# EasyEDA schematic SCH_GP40_R1A.json

## Sheets
1 01_main: TITLE: GALAKSIJA 40th Anniversary Tribute; REV: 1.0; Date: 2023-12-30; Sheet: 0/3; Drawn By: mikica; Company: Umuntu ngumuntu ngabantu
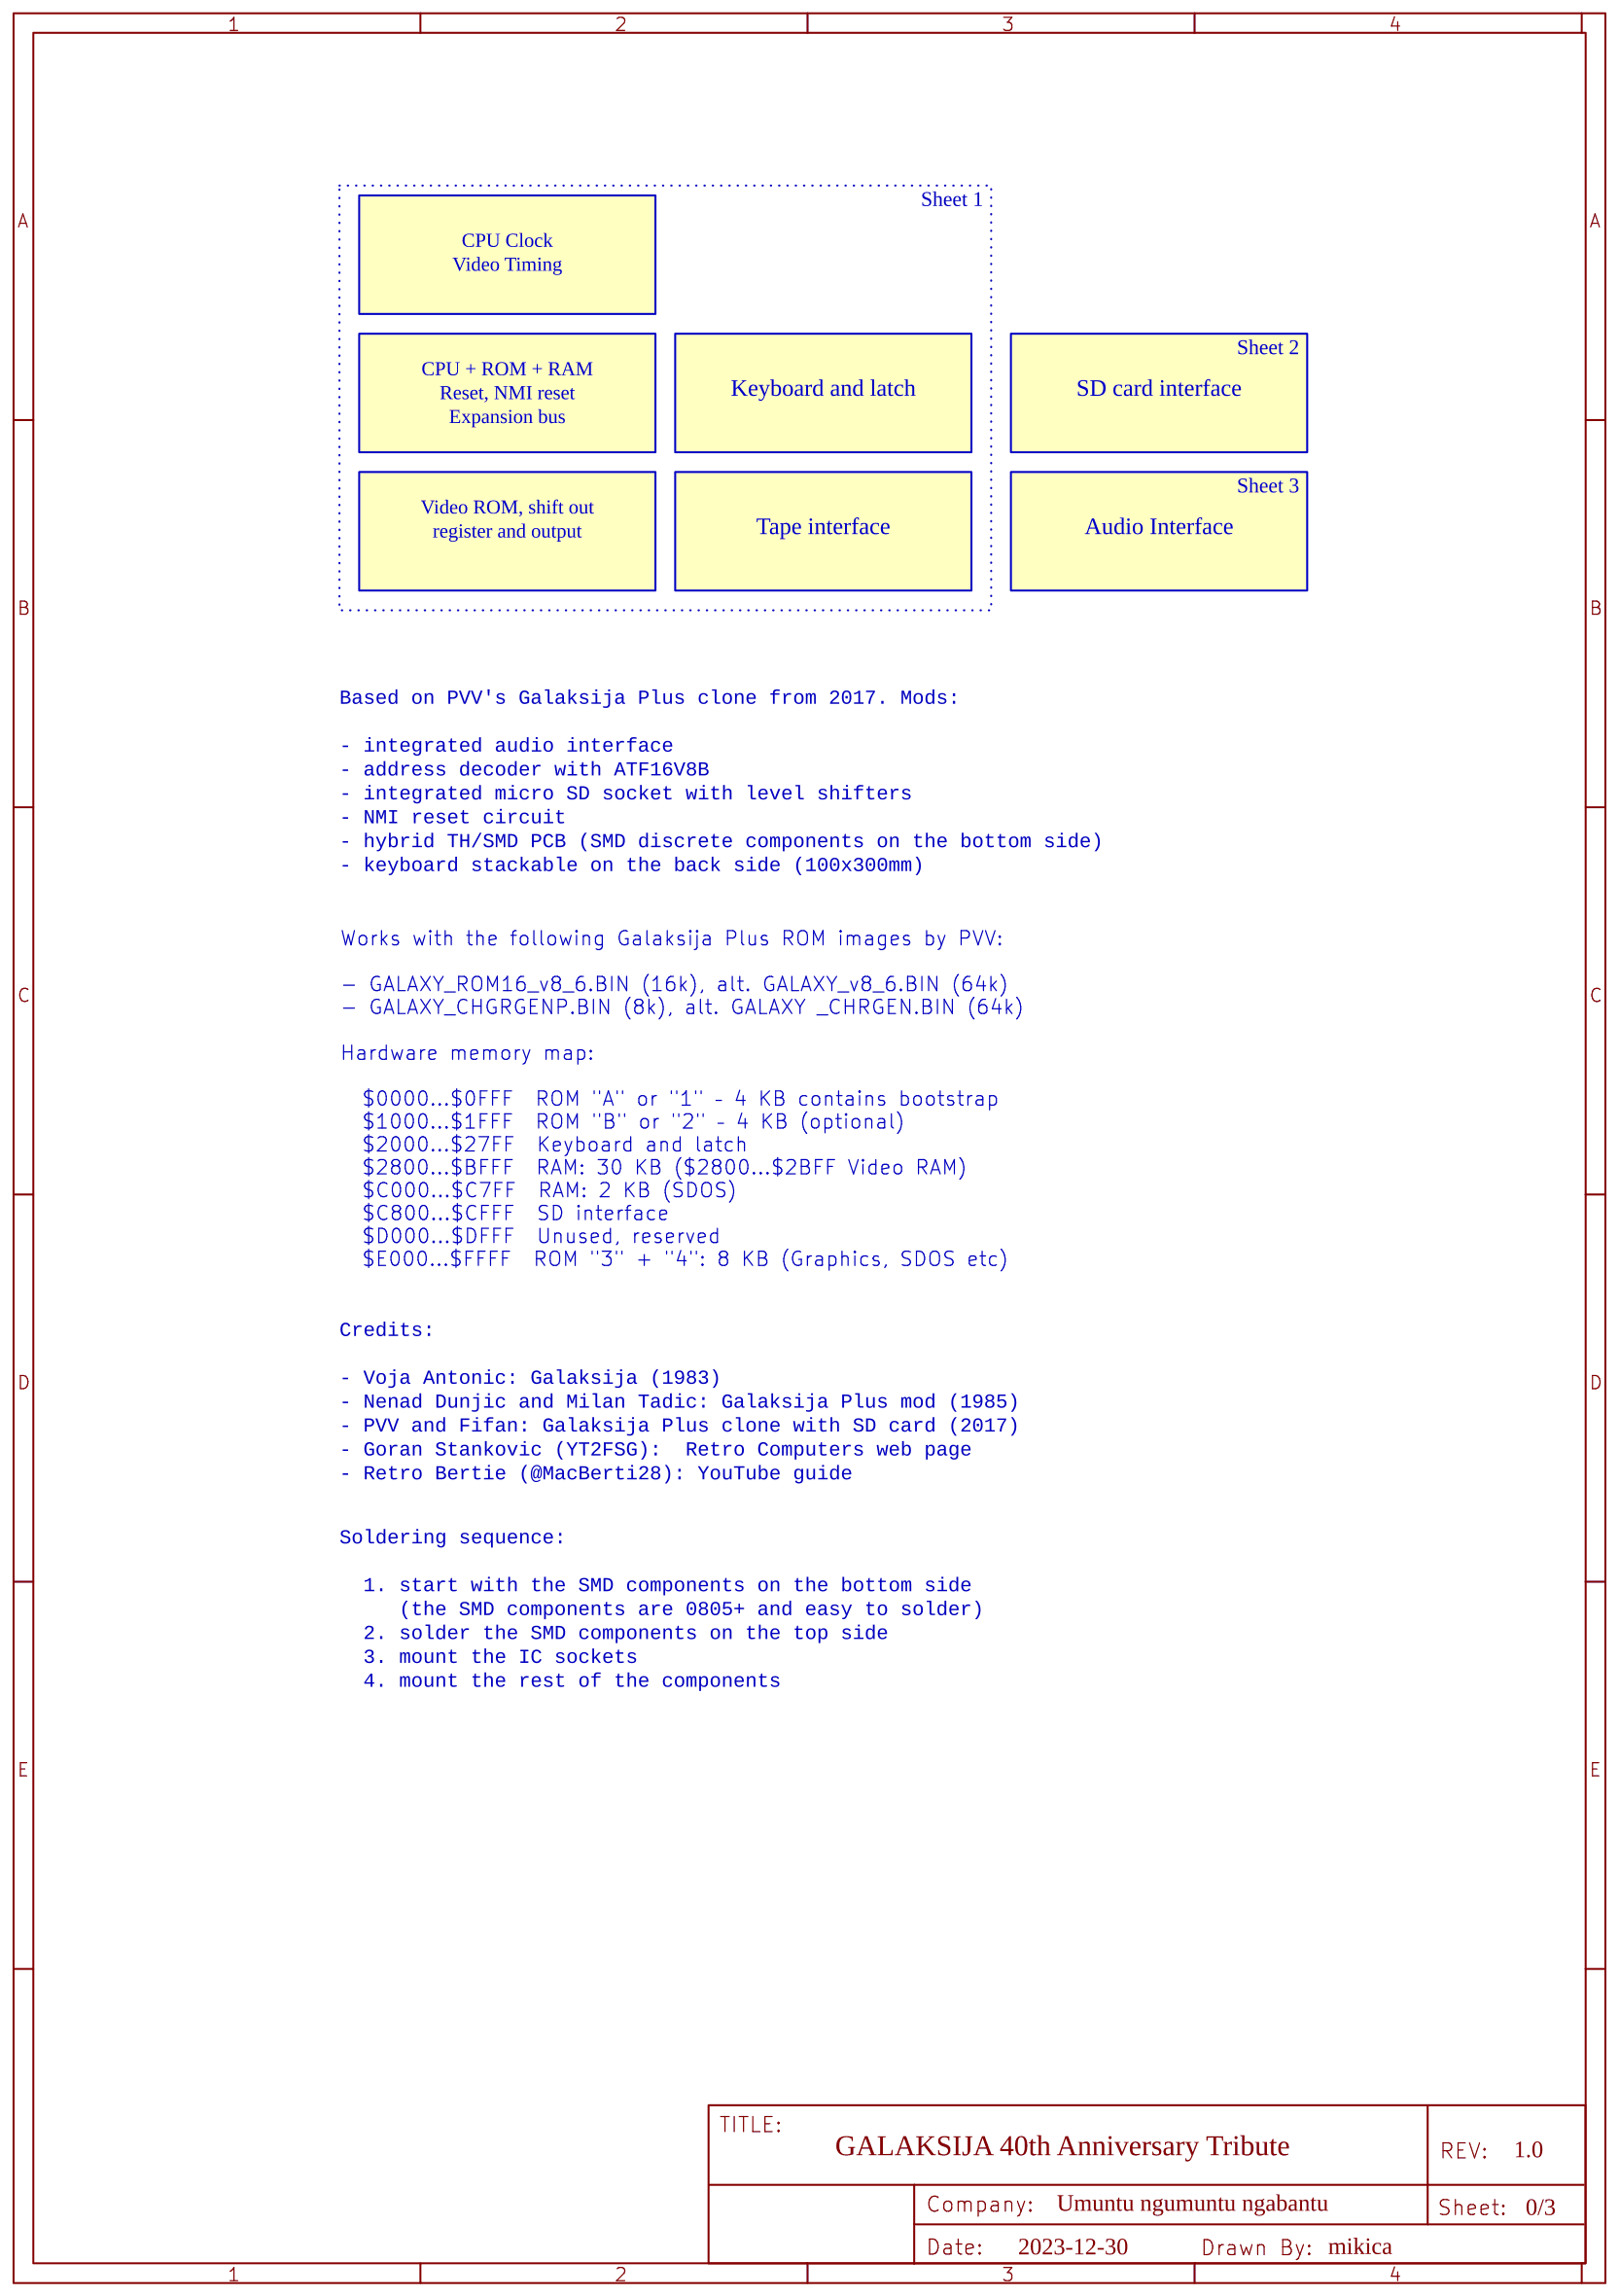
[diagram p0: 01_main]
2 02_galaksija: TITLE: GALAKSIJA PLUS; Date: 2023-12-20; Sheet: 1/3
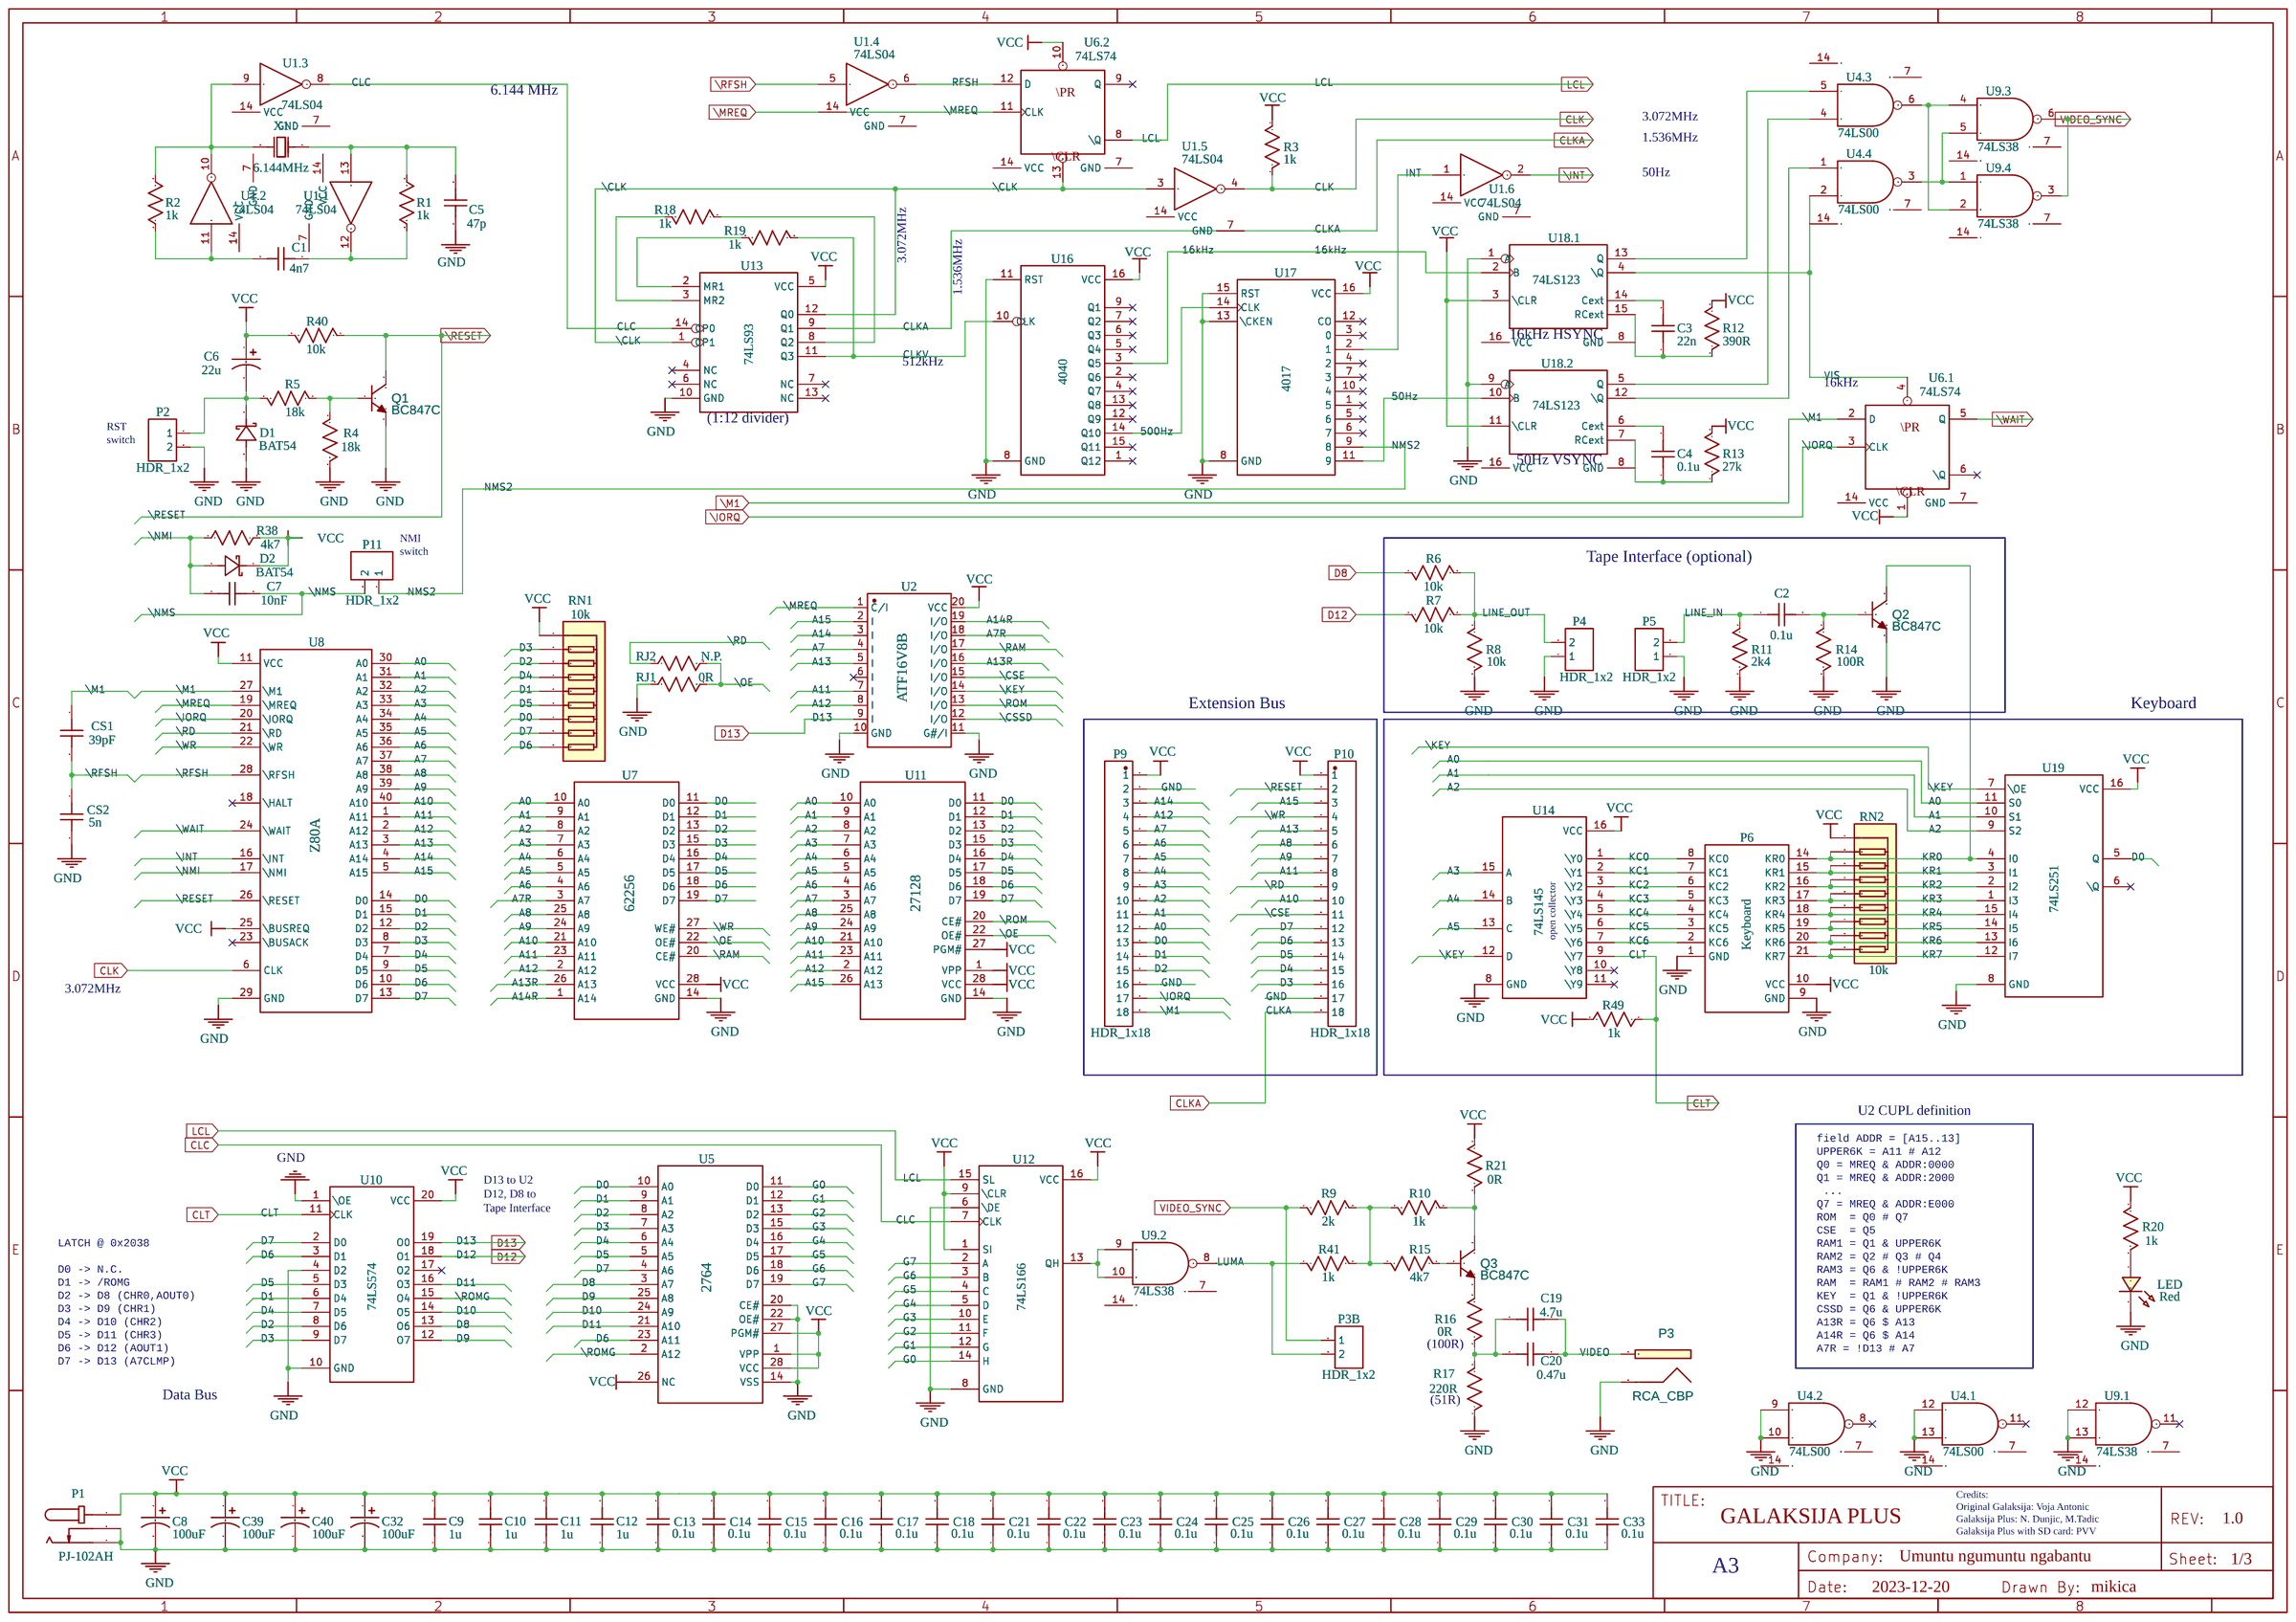
[diagram p1: 02_galaksija]
3 03_sdcard: TITLE: GALAKSIJA SD Card Interface; Date: 2023-12-24; Sheet: 2/3
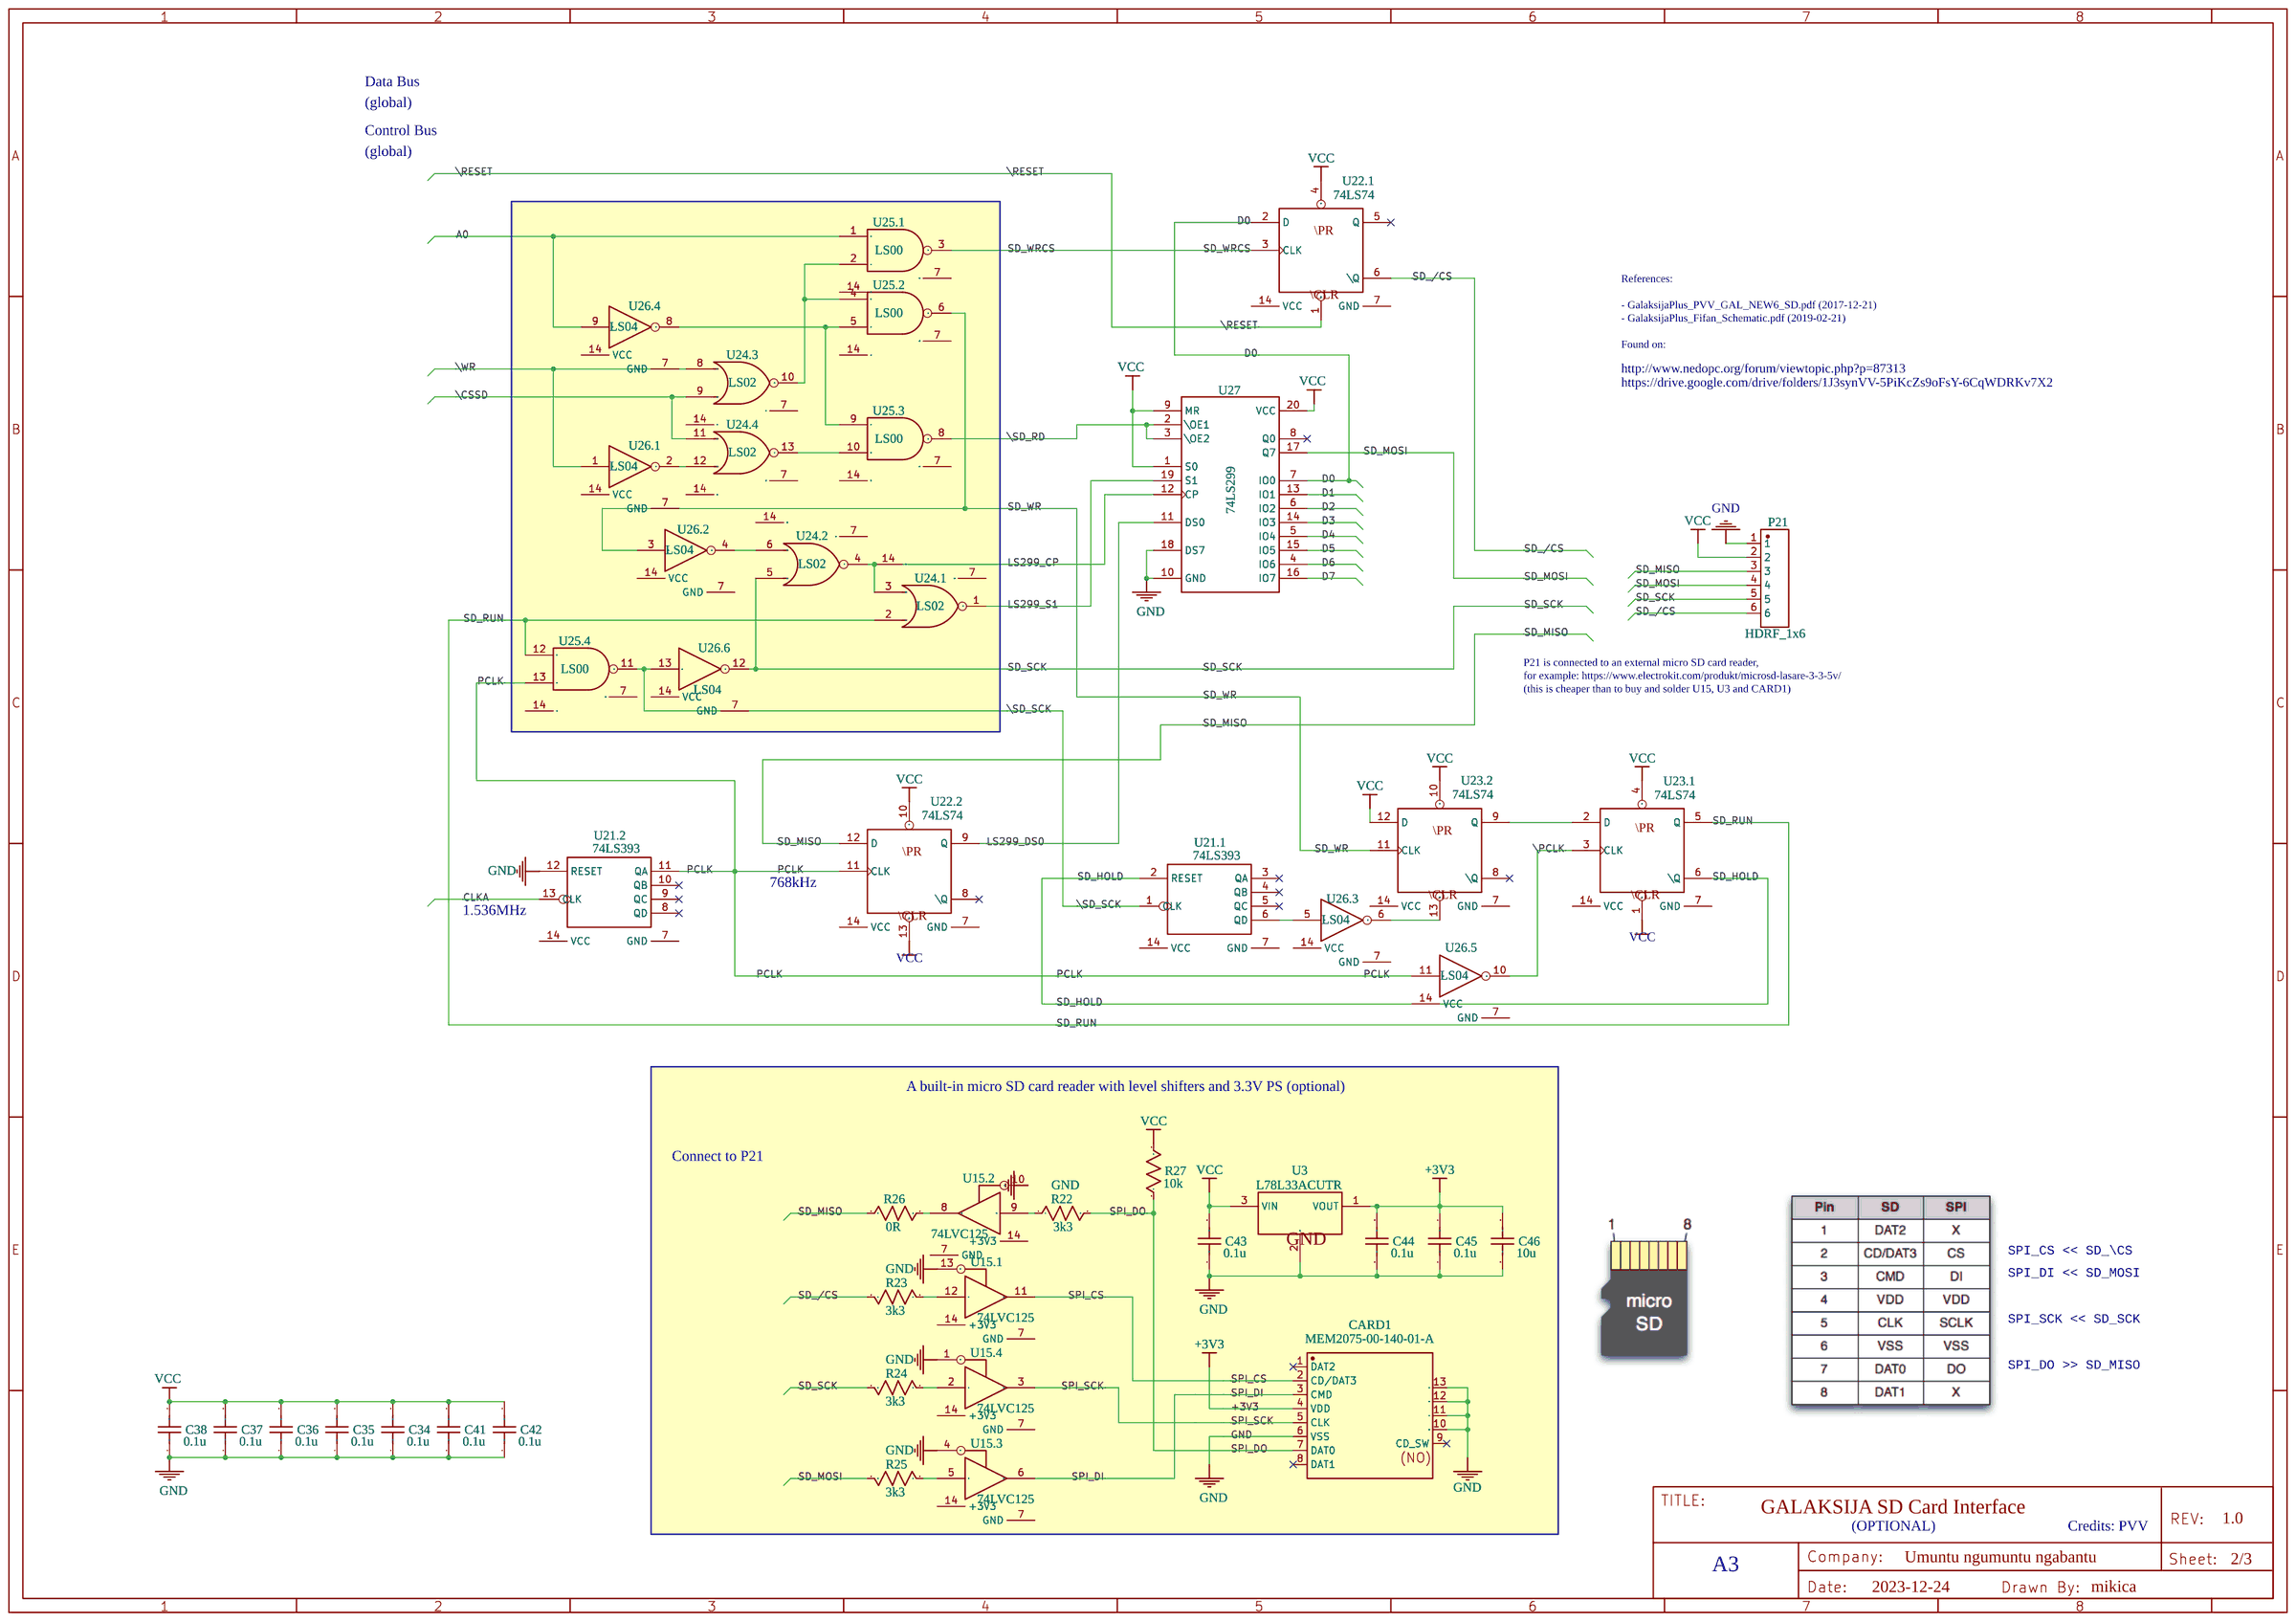
[diagram p2: 03_sdcard]
4 04_audio: TITLE: GALAKSIJA Audio Interface; Date: 2023-12-29; Sheet: 3/3
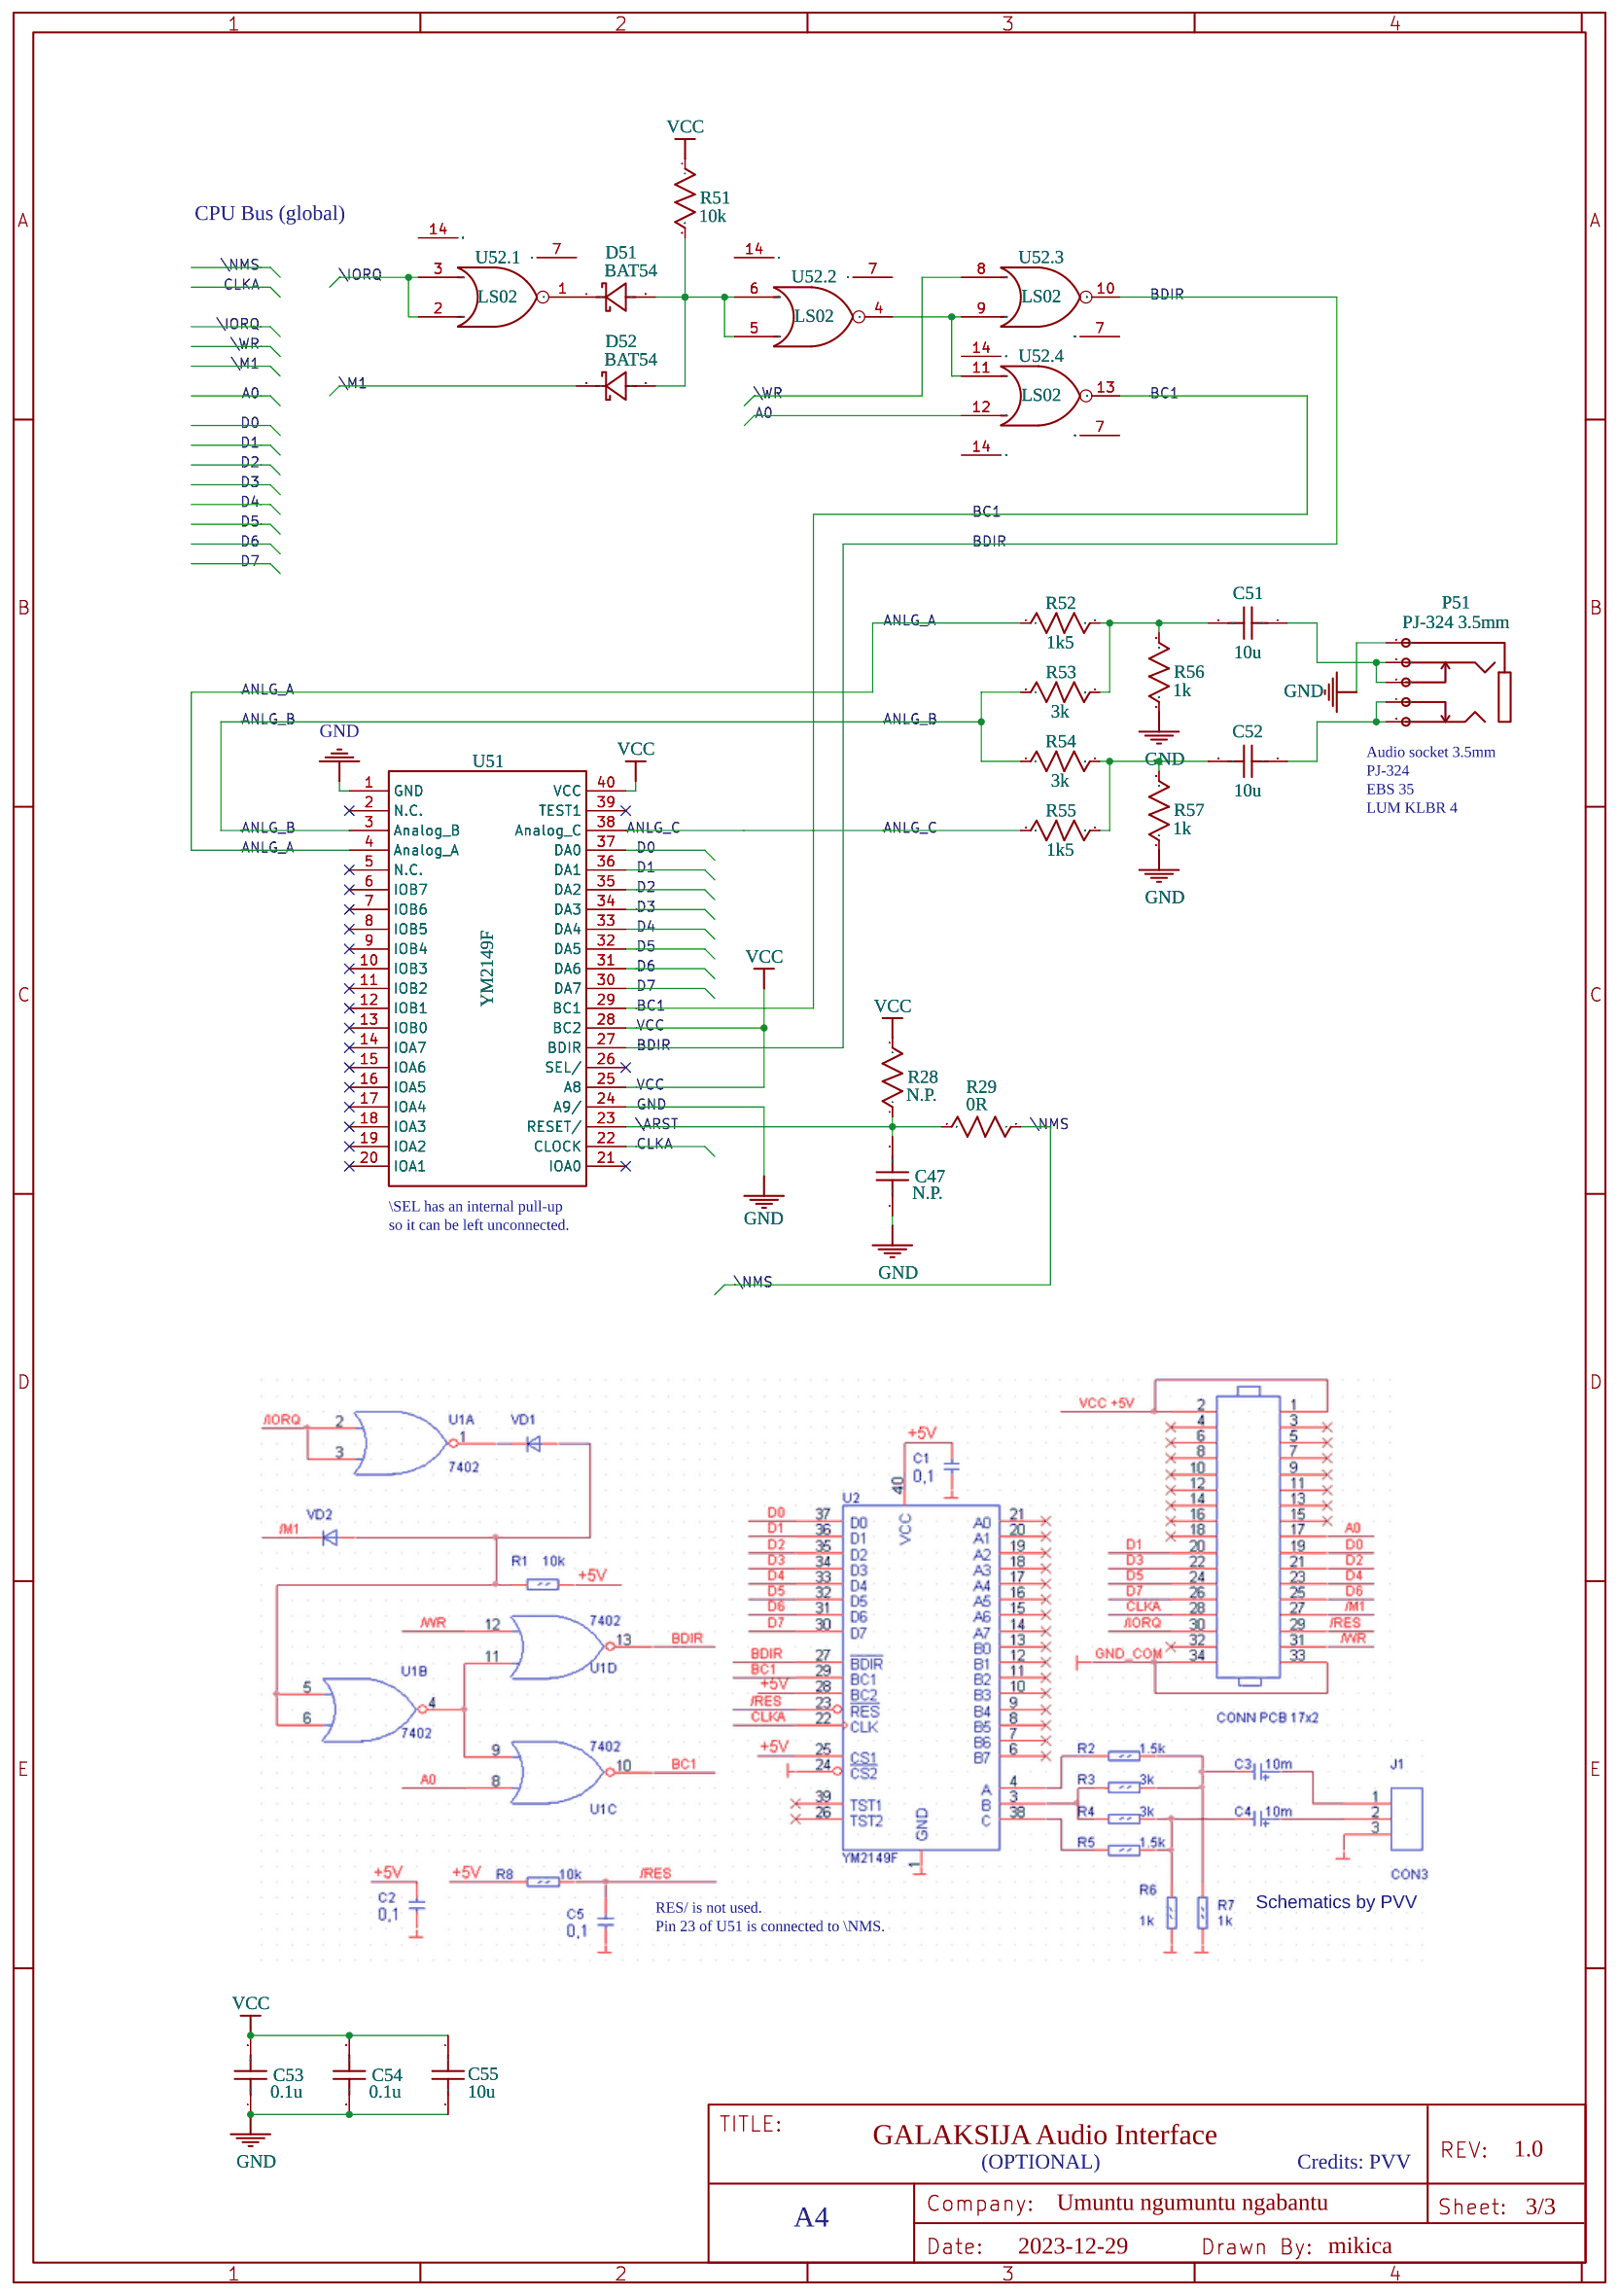
[diagram p3: 04_audio]

## Parts
sheet 02_galaksija
C1  4n7  [C0805_MK]
C2  0.1u  [C0805_MK]
C3  22n  [C0805_MK]
C4  0.1u  [C0805_MK]
C5  47p  [C0805_MK]
C6  22u  [CASE-B_3528]
C7  10nF  [C0805_MK]
C8  100uF  [CASE-D_7343]
C9  1u  [C1210]
C10  1u  [C1210]
C11  1u  [C1210]
C12  1u  [C1210]
C13  0.1u  [C0805_MK]
C14  0.1u  [C0805_MK]
C15  0.1u  [C0805_MK]
C16  0.1u  [C0805_MK]
C17  0.1u  [C0805_MK]
C18  0.1u  [C0805_MK]
C19  4.7u  [C1210]
C20  0.47u  [C1206]
C21  0.1u  [C0805_MK]
C22  0.1u  [C0805_MK]
C23  0.1u  [C0805_MK]
C24  0.1u  [C0805_MK]
C25  0.1u  [C0805_MK]
C26  0.1u  [C0805_MK]
C27  0.1u  [C0805_MK]
C28  0.1u  [C0805_MK]
C29  0.1u  [C0805_MK]
C30  0.1u  [C0805_MK]
C31  0.1u  [C0805_MK]
C32  100uF  [CASE-D_7343]
C33  0.1u  [C0805_MK]
C39  100uF  [CASE-D_7343]
C40  100uF  [CASE-D_7343]
CS1  39pF  [RAD-0.1]
CS2  5n  [RAD-0.1]
D1  BAT54  [SOD-123_L2.7-W1.6-LS3.6-RD]
D2  BAT54  [SOD-123_L2.7-W1.6-LS3.6-RD]
LED  Red  [LED-TH_BD3.0_RED]
P1  PJ-102AH  [DC-IN-TH_PJ-102AH]
P2  HDR_1x2  [HDR-M-2.54_1X2]
P3  RCA_CBP  [RCA_CBP]
P3B  HDR_1x2  [HDR-M-2.54_1X2]
P4  HDR_1x2  [HDR-M-2.54_1X2]
P5  HDR_1x2  [HDR-M-2.54_1X2]
P6  Keyboard  [GP40_KBD]
P9  HDR_1x18  [HDR-TH_18P-P2.54-V-M]
P10  HDR_1x18  [HDR-TH_18P-P2.54-V-M]
P11  HDR_1x2  [HDR-M-2.54_1X2]
Q1  BC847C  [SOT-23-3_MK]
Q2  BC847C  [SOT-23-3_MK]
Q3  BC847C  [SOT-23-3_MK]
R1  1k  [R0805_MK]
R2  1k  [R0805_MK]
R3  1k  [R0805_MK]
R4  18k  [R0805_MK]
R5  18k  [R0805_MK]
R6  10k  [R0805_MK]
R7  10k  [R0805_MK]
R8  10k  [R0805_MK]
R9  2k  [R0805_MK]
R10  1k  [R0805_MK]
R11  2k4  [R0805_MK]
R12  390R  [R0805_MK]
R13  27k  [R0805_MK]
R14  100R  [R0805_MK]
R15  4k7  [R0805_MK]
R16  0R  [R0805_MK]
R17  220R  [R0805_MK]
R18  1k  [R0805_MK]
R19  1k  [R0805_MK]
R20  1k  [R0805_MK]
R21  0R  [R1206]
R38  4k7  [R0805_MK]
R40  10k  [R0805_MK]
R41  1k  [R0805_MK]
R49  1k  [R0805_MK]
RJ1  0R  [R0603_MK]
RJ2  N.P.  [R0603_MK]
RN1  10k  [RES-ARRAY-TH_9P-P2.54-D1.0_MK]
RN2  10k  [RES-ARRAY-TH_9P-P2.54-D1.0_MK]
U1  74LS04  [DIP-14-150-SOCKET]  (sections 1,2,3,4,5,6)
U2  ATF16V8B  [DIP-20-150-SOCKET]
U4  74LS00  [DIP-14-150-SOCKET]  (sections 1,2,3,4)
U5  2764  [DIP-28-600-SOCKET]
U6  74LS74  [DIP-14-150-SOCKET]  (sections 1,2)
U7  62256  [DIP-28-600-SOCKET]
U8  Z80A  [DIP-40-SOCKET]
U9  74LS38  [DIP-14-150-SOCKET]  (sections 1,2,3,4)
U10  74LS574  [DIP-20-150-SOCKET]
U11  27128  [DIP-28-600-SOCKET]
U12  74LS166  [DIP-16-150-SOCKET]
U13  74LS93  [DIP-14-150-SOCKET]
U14  74LS145  [DIP-16-150-SOCKET]
U16  4040  [DIP-16-150-SOCKET]
U17  4017  [DIP-16-150-SOCKET]
U18  74LS123  [DIP-16-150-SOCKET]  (sections 1,2)
U19  74LS251  [DIP-16-150-SOCKET]
X1  6.144MHz  [OSC-TH_L10.0-W4.5-P5.00]
sheet 03_sdcard
C34  0.1u  [C0805_MK]
C35  0.1u  [C0805_MK]
C36  0.1u  [C0805_MK]
C37  0.1u  [C0805_MK]
C38  0.1u  [C0805_MK]
C41  0.1u  [C0805_MK]
C42  0.1u  [C0805_MK]
C43  0.1u  [C0603_MK]
C44  0.1u  [C0603_MK]
C45  0.1u  [C0603_MK]
C46  10u  [C0805_MK]
CARD1  MEM2075-00-140-01-A  [MEM2075-00-140-01-A_MK]
P21  HDRF_1x6  [HDR-TH_6P-P2.54-V-F]
R22  3k3  [R0603_MK]
R23  3k3  [R0603_MK]
R24  3k3  [R0603_MK]
R25  3k3  [R0603_MK]
R26  0R  [R0603_MK]
R27  10k  [R0603_MK]
U3  L78L33ACUTR  [SOT-89-3_L4.5-W2.5-P1.50-LS4.2-TL]
U15  74LVC125  [SOIC-14_L8.6-W3.8-P1.27-LS6.0-BL]  (sections 1,2,3,4)
U21  74LS393  [DIP-14-150-SOCKET]  (sections 1,2)
U22  74LS74  [DIP-14-150-SOCKET]  (sections 1,2)
U23  74LS74  [DIP-14-150-SOCKET]  (sections 1,2)
U24  LS02  [DIP-14-150-SOCKET]  (sections 1,2,3,4)
U25  LS00  [DIP-14-150-SOCKET]  (sections 1,2,3,4)
U26  LS04  [DIP-14-150-SOCKET]  (sections 1,2,3,4,5,6)
U27  74LS299  [DIP-20-150-SOCKET]
sheet 04_audio
C47  N.P.  [C0805_MK]
C51  10u  [C1210]
C52  10u  [C1210]
C53  0.1u  [C0805_MK]
C54  0.1u  [C0805_MK]
C55  10u  [C1210]
D51  BAT54  [SOD-123_L2.7-W1.6-LS3.6-RD]
D52  BAT54  [SOD-123_L2.7-W1.6-LS3.6-RD]
P51  PJ-324 3.5mm  [AUDIO-TH_PJ324]
R28  N.P.  [R0805_MK]
R29  0R  [R0805_MK]
R51  10k  [R0805_MK]
R52  1k5  [R0805_MK]
R53  3k  [R0805_MK]
R54  3k  [R0805_MK]
R55  1k5  [R0805_MK]
R56  1k  [R0805_MK]
R57  1k  [R0805_MK]
U51  YM2149F  [DIP-40-SOCKET]
U52  LS02  [DIP-14-150-SOCKET]  (sections 1,2,3,4)

## Library data of the parts
C1-C5 C13-C18 C20-C31 C33-C38 C41-C47 C53 C54 = C_0805_US: Contributor: LCEDA_Lib
C6 = C_Tan_SMD_A_US: Contributor: LCEDA_Lib
C7 C9-C12 C19 C51 C52 C55 = C_1206_US: Contributor: LCEDA_Lib
C8 C32 C39 C40 = C_Tan_SMD_D_US: Contributor: LCEDA_Lib
CS1 CS2 = C_RAD-0.1_US: Contributor: LCEDA_Lib
D1 D2 D51 D52 = BAT54GWX: Supplier: Digi-Key; Supplier Part: BAT54XV2T1GOSCT-ND; Manufacturer: Onsemi; Manufacturer Part: BAT54XV2T1G; Contributor: LCSC
LED = LED-TH-3mm_R: Manufacturer: EVERLIGHT(台湾亿光); Manufacturer Part: 204-10SDRD/S530-A3-L; Supplier Part: C84774; Supplier: LCSC; Contributor: LCEDA_Lib
P1 = PJ-102AH: Contributor: lcsc; Supplier: Electrokit; Supplier Part: 41013585; Manufacturer: null; JLCPCB Part Class: Extended Part
P2 P3B P4 P5 P11 = HDR-M-2.54_1x2: Supplier Part: C124375; Supplier: LCSC; Contributor: LCEDA_Lib
P3 = RCA_CBP: Contributor: Domenik Schmid; Supplier Part: 41001410; Supplier: Electrokit
P6 = GP40_KBD: Contributor: mikica
P9 P10 = KH-2.54PH180-1X18P-L11.5: Contributor: LCSC; Supplier: LCSC; Supplier Part: C2905492; Manufacturer: kinghelm(金航标); JLCPCB Part Class: Extended Part
Q1-Q3 = BC847C-TP: Contributor: LCSC; Supplier: Digi-Key; Supplier Part: 4786-BC847CCT-ND; Manufacturer: Good-Ark
R1-R29 R38 R40 R41 R49 R51-R57 RJ1 RJ2 = R_0805_US: Contributor: LCEDA_Lib
RN1 RN2 = A09-101JP: Supplier: LCSC; Manufacturer: FH; Supplier Part: C29541; link: https://lcsc.com/eda_search?q=C29541&%26type=1&ref=editor
U1 U26 = HD74LS04P: Hex Inverters; subpart_no: 1
U2 = GAL16V8-20LNC: Supplier: Digi-Key; Supplier Part: ATF16V8B-15PU; Manufacturer: Atmel; Manufacturer Part: ATF16V8B-15PU; Contributor: lcsc; link: https://lcsc.com/eda_search?q=C3273127&%26type=1&ref=editor
U4 U25 = HD74LS00P: Quad 2-Input NAND Gates; subpart_no: 1
U5 = 2764: Contributor: mikica; Supplier: Digi-Key; Supplier Part: AT27C512R-45PU-ND; Manufacturer: Microchip; Manufacturer Part: AT27C512R-45PU
U6 U22 U23 = SN74LS74AN: Dual D-Type Positive Edge-Triggered Flip-Flop; subpart_no: 1
U7 = 62256: Contributor: mikica; Supplier: RS-Online; Supplier Part: 538-148; Manufacturer: Alliance; Manufacturer Part: AS6C62256-55PCN
U8 = Z80A: Manufacturer: ZiLOG, Inc.; Manufacturer Part: Z84C0008PEG; Supplier: RS-Online; Supplier Part: 625-8918; link: https://www.mouser.com/datasheet/2/240/ps0178-2584834.pdf; Contributor: mikica
U9 = HD74LS38P: Quad 2-Input NAND Buffers with Open Collector Outputs; subpart_no: 1
U10 = DM74LS574N: Octal D-Type Flip-Flop with 3-State Output
U11 = 27128: Contributor: mikica; Supplier: Digi-Key; Supplier Part: AT27C512R-45PU-ND; Manufacturer: Microchip; Manufacturer Part: AT27C512R-45PU
U12 = SN74LS166N: 8-Bit Shift Register
U13 = SN74LS93J: 4-Bit Binary Counter
U14 = SN74LS145N: 1-of-10 DecoderDriver with Open-Collector Outputs
U16 = CD4040BCN: 12-Stage Ripple Carry Binary Counter
U17 = CD4017BCN: Decade CounterDivider with 10 Decoded Outputs
U18 = DM74LS123N: Dual Retriggerable One-Shot with Clear and Complementary Outputs; subpart_no: 1
U19 = SN74LS251N: 8-Input Multiplexer with 3-State Outputs
X1 = A-3.579545-30-SL-TR: Contributor: LCSC; Supplier: RS-Online; Supplier Part: 814-9409; Manufacturer: Quantek; Manufacturer Part: QCL6.14400F18B23B
CARD1 = MEM2075-00-140-01-A_MK: Supplier: Digi-Key; Supplier Part: 2073-MEM2075-00-140-01-ACT-ND; Manufacturer: GCT; Contributor: mikica; link: https://www.digikey.com/en/products/detail/gct/MEM2075-00-140-01-A/9859614
P21 = Header-Female-2.54_1x6: Supplier: LCSC; Manufacturer: BOOMELE(博穆精密); Manufacturer Part: 2.54-1*6P母; Supplier Part: C40877; JLCPCB Part Class: Extended Part; link: https://lcsc.com/eda_search?q=C40877&%26type=1&ref=editor
U3 = L78L33ACUTR: Supplier: LCSC; Manufacturer: ST(意法半导体); Supplier Part: C14170; JLCPCB Part Class: Extended Part
U15 = RD74LVC125BT: Quad Bus Buffer Gates with 3-State Outputs; subpart_no: 1; Manufacturer Part: SN74LVC125ADR; Supplier: Digi-Key; Supplier Part: 296-8453-1-ND; Manufacturer: TI
U21 = SN74LS393N: Dual 4-Stage Binary Counter; subpart_no: 1
U24 U52 = HD74LS02P: Quad 2-Input NOR Gates; subpart_no: 1
U27 = DM74LS299WM: 8-Input Universal ShiftStorage Register with Common IO Pin
P51 = PJ-324 3.5mmAudio sockets: Supplier: Electrokit; Manufacturer: ReliaPro; Supplier Part: 41001189; JLCPCB Part Class: Extended Part
U51 = YM2149F: Contributor: fiks1111

## Nets
+3V3: C44.2 C45.2 C46.2 CARD1.4(VDD) U3.1(VOUT)
GND: C5.1 C8.2 C9.1 C10.1 C11.1 C12.1 C13.1 C14.1 C15.1 C16.1 C17.1 C18.1 C21.1 C22.1 C23.1 C24.1 C25.1 C26.1 C27.1 C28.1 C29.1 C30.1 C31.1 C32.2 C33.1 C34.1 C35.1 C36.1 C37.1 C38.1 C39.2 C40.2 C41.1 C42.1 C43.1 C44.1 C45.1 C46.1 C47.1 C53.1 C54.1 C55.2 CARD1.6(VSS) CARD1.10 CARD1.11 CARD1.12 CARD1.13 CS2.2 D1.2(A) LED.2 P1.2 P1.3 P2.2 P3.SHELL P4.1 P5.1 P6.1(GND) P6.9(GND) P9.2 P9.16 P10.17 P21.1 P51.1 Q1.2(E) Q2.2(E) R4.2 R8.2 R11.2 R14.2 R17.1 R56.2 R57.1 RJ1.1 U2.10(GND) U2.11(G#/I) U3.2(GND) U4.9(3A) U4.10(3B) U4.12(4A) U4.13(4B) U5.14(VSS) U5.20(CE#) U5.22(OE#) U7.14(GND) U8.29(GND) U9.12(4A) U9.13(4B) U10.1(\OE) U10.4(D2) U10.10(GND) U11.14(GND) U12.6(\DE) U12.8(GND) U13.10(GND) U14.8(GND) U15.1(1OE) U15.4(2OE) U15.10(3OE) U15.13(4OE) U16.8(GND) U16.11(RST) U17.8(GND) U17.13(\CKEN) U17.15(RST) U18.1(A) U18.9(A) U19.8(GND) U21.12(RESET) U27.10(GND) U27.18(DS7) U51.1(GND) U51.24(A9/)
VCC: C6.1 C8.1 C9.2 C10.2 C11.2 C12.2 C13.2 C14.2 C15.2 C16.2 C17.2 C18.2 C21.2 C22.2 C23.2 C24.2 C25.2 C26.2 C27.2 C28.2 C29.2 C30.2 C31.2 C32.1 C33.2 C34.2 C35.2 C36.2 C37.2 C38.2 C39.1 C40.1 C41.2 C42.2 C43.2 C53.2 C54.2 C55.1 D2.1(K) P1.1 P6.10(VCC) P9.1 P10.1 P21.2 R3.1 R12.2 R13.2 R20.1 R21.1 R27.2 R28.2 R38.1 R40.2 R49.1 R51.1 RN1.1 RN2.1 U2.20(VCC) U3.3(VIN) U5.1(VPP) U5.26(NC) U5.27(PGM#) U5.28(VCC) U6.1(CLR) U6.10(PR) U7.28(VCC) U8.11(VCC) U8.25(\BUSREQ) U10.20(VCC) U11.1(VPP) U11.27(PGM#) U11.28(VCC) U12.1(SI) U12.9(\CLR) U12.16(VCC) U13.5(VCC) U14.16(VCC) U16.16(VCC) U17.16(VCC) U18.3(\CLR) U18.11(\CLR) U19.16(VCC) U22.4(PR) U22.10(PR) U22.13(CLR) U23.1(CLR) U23.4(PR) U23.10(PR) U23.12(D) U27.1(S0) U27.9(MR) U27.20(VCC) U51.25(A8) U51.28(BC2) U51.40(VCC)
16kHz: U16.3(Q5) U18.2(B)
50Hz: U17.11(9) U18.10(B)
500Hz: U16.14(Q10) U17.14(CLK)
\ARST: C47.2 R28.1 R29.2 U51.23(RESET/)
\CLK: U1.3(2A) U6.13(CLR) U13.1(CP1) U13.12(Q0)
\CSE: P10.11 U2.15(I/O)
\CSSD: U2.12(I/O) U24.9(3B) U24.11(4A)
\INT: U1.2(1Y) U8.16(\INT)
\IORQ: P9.17 U6.3(CLK) U8.20(\IORQ) U52.2(1A) U52.3(1B)
\KEY: U2.14(I/O) U14.12(D) U19.7(\OE)
\M1: CS1.1 D52.1(K) P9.18 U6.2(D) U8.27(\M1)
\MREQ: U2.1(C/I) U6.11(CLK) U8.19(\MREQ)
\NMI: C7.1 D2.2(A) R38.2 U8.17(\NMI)
\NMS: C7.2 P11.2 R29.1
\OE: RJ1.2 RJ2.2 U7.22(OE#) U11.22(OE#)
\PCLK: U23.3(CLK) U26.10(5Y)
\RAM: U2.17(I/O) U7.20(CE#)
\RD: P10.9 RJ2.1 U8.21(\RD)
\RESET: P10.2 Q1.3(C) R40.1 U8.26(\RESET) U22.1(CLR)
\RFSH: CS1.2 CS2.1 U1.5(3A) U8.28(\RFSH)
\ROM: U2.13(I/O) U11.20(CE#)
\ROMG: U5.2(A12) U10.15(O4)
\SD_RD: U25.8(3Y) U27.2(\OE1) U27.3(\OE2)
\SD_SCK: U21.1(CLK) U25.11(4Y) U26.13(6A)
\WAIT: U6.5(Q) U8.24(\WAIT)
\WR: P10.4 U7.27(WE#) U8.22(\WR) U24.8(3A) U26.1(1A) U52.8(3A)
A0: P9.12 U7.10(A0) U8.30(A0) U11.10(A0) U19.11(S0) U25.1(1A) U26.9(4A) U52.12(4B)
A1: P9.11 U7.9(A1) U8.31(A1) U11.9(A1) U19.10(S1)
A2: P9.10 U7.8(A2) U8.32(A2) U11.8(A2) U19.9(S2)
A3: P9.9 U7.7(A3) U8.33(A3) U11.7(A3) U14.15(A)
A4: P9.8 U7.6(A4) U8.34(A4) U11.6(A4) U14.14(B)
A5: P9.7 U7.5(A5) U8.35(A5) U11.5(A5) U14.13(C)
A6: P9.6 U7.4(A6) U8.36(A6) U11.4(A6)
A7: P9.5 U2.4(I) U8.37(A7) U11.3(A7)
A7R: U2.18(I/O) U7.3(A7)
A8: P10.6 U7.25(A8) U8.38(A8) U11.25(A8)
A9: P10.7 U7.24(A9) U8.39(A9) U11.24(A9)
A10: P10.10 U7.21(A10) U8.40(A10) U11.21(A10)
A11: P10.8 U2.7(I) U7.23(A11) U8.1(A11) U11.23(A11)
A12: P9.4 U2.8(I) U7.2(A12) U8.2(A12) U11.2(A12)
A13: P10.5 U2.5(I) U8.3(A13)
A13R: U2.16(I/O) U7.26(A13)
A14: P9.3 U2.3(I) U8.4(A14)
A14R: U2.19(I/O) U7.1(A14)
A15: P10.3 U2.2(I) U8.5(A15) U11.26(A13)
ANLG_A: R52.1 U51.4(Analog A)
ANLG_B: R53.1 R54.1 U51.3(Analog B)
ANLG_C: R55.1 U51.38(Analog C)
BC1: U51.29(BC1) U52.13(4Y)
BDIR: U51.27(BDIR) U52.10(3Y)
CLC: U1.8(4Y) U12.7(CLK) U13.14(CP0)
CLK: R3.2 U1.4(2Y) U8.6(CLK)
CLKA: P10.18 U13.9(Q1) U21.13(CLK) U51.22(CLOCK)
CLKV: R19.1 U13.11(Q3) U16.10(CLK)
CLT: R49.2 U10.11(CLK) U14.9(\Y7)
D0: P9.13 RN1.7 U5.10(A0) U7.11(D0) U8.14(D0) U11.11(D0) U19.5(Q) U22.2(D) U27.7(IO0) U51.37(DA0)
D1: P9.14 RN1.5 U5.9(A1) U7.12(D1) U8.15(D1) U10.6(D4) U11.12(D1) U27.13(IO1) U51.36(DA1)
D2: P9.15 RN1.3 U5.8(A2) U7.13(D2) U8.12(D2) U10.8(D6) U11.13(D2) U27.6(IO2) U51.35(DA2)
D3: P10.16 RN1.2 U5.7(A3) U7.15(D3) U8.8(D3) U10.9(D7) U11.15(D3) U27.14(IO3) U51.34(DA3)
D4: P10.15 RN1.4 U5.6(A4) U7.16(D4) U8.7(D4) U10.7(D5) U11.16(D4) U27.5(IO4) U51.33(DA4)
D5: P10.14 RN1.6 U5.5(A5) U7.17(D5) U8.9(D5) U10.5(D3) U11.17(D5) U27.15(IO5) U51.32(DA5)
D6: P10.13 RN1.9 U5.23(A11) U7.18(D6) U8.10(D6) U10.3(D1) U11.18(D6) U27.4(IO6) U51.31(DA6)
D7: P10.12 RN1.8 U5.4(A6) U7.19(D7) U8.13(D7) U10.2(D0) U11.19(D7) U27.16(IO7) U51.30(DA7)
D8: R6.1 U5.3(A7) U10.13(O6)
D9: U5.25(A8) U10.12(O7)
D10: U5.24(A9) U10.14(O5)
D11: U5.21(A10) U10.16(O3)
D12: R7.1 U10.18(O1)
D13: U2.9(I) U10.19(O0)
G0: U5.11(D0) U12.14(H)
G1: U5.12(D1) U12.12(G)
G2: U5.13(D2) U12.11(F)
G3: U5.15(D3) U12.10(E)
G4: U5.16(D4) U12.5(D)
G5: U5.17(D5) U12.4(C)
G6: U5.18(D6) U12.3(B)
G7: U5.19(D7) U12.2(A)
INT: U1.1(1A) U17.2(1)
KC0: P6.8(KC0) U14.1(\Y0)
KC1: P6.7(KC1) U14.2(\Y1)
KC2: P6.6(KC2) U14.3(\Y2)
KC3: P6.5(KC3) U14.4(\Y3)
KC4: P6.4(KC4) U14.5(\Y4)
KC5: P6.3(KC5) U14.6(\Y5)
KC6: P6.2(KC6) U14.7(\Y6)
KR0: P6.14(KR0) Q2.3(C) RN2.2 U19.4(I0)
KR1: P6.15(KR1) RN2.3 U19.3(I1)
KR2: P6.16(KR2) RN2.4 U19.2(I2)
KR3: P6.17(KR3) RN2.5 U19.1(I3)
KR4: P6.18(KR4) RN2.6 U19.15(I4)
KR5: P6.19(KR5) RN2.7 U19.14(I5)
KR6: P6.20(KR6) RN2.8 U19.13(I6)
KR7: P6.21(KR7) RN2.9 U19.12(I7)
LCL: U6.8(\Q) U12.15(SL)
LINE_IN: C2.1 P5.2 R11.1
LINE_OUT: P4.2 R6.2 R7.2 R8.1
LS299_CP: U24.3(1B) U24.4(2Y) U24.14(VCC) U27.12(CP)
LS299_DS0: U22.9(Q) U27.11(DS0)
LS299_S1: U24.1(1Y) U27.19(S1)
LUMA: P3B.2 R41.1 U9.8(3Y)
NMS2: P11.1 U17.9(8)
PCLK: U21.11(QA) U22.11(CLK) U25.13(4B) U26.11(5A)
RFSH: U1.6(3Y) U6.12(D)
SD_/CS: P21.6 R23.2 U22.6(\Q)
SD_HOLD: U21.2(RESET) U23.6(\Q)
SD_MISO: P21.3 R26.1 U22.12(D)
SD_MOSI: P21.4 R25.2 U27.17(Q7)
SD_RUN: U23.5(Q) U24.2(1A) U25.12(4A)
SD_SCK: P21.5 R24.2 U24.5(2A) U26.12(6Y)
SD_WR: U23.11(CLK) U25.6(2Y) U26.3(2A)
SD_WRCS: U22.3(CLK) U25.3(1Y)
SPI_CS: CARD1.2(CD/DAT3) U15.11(4Y)
SPI_DI: CARD1.3(CMD) U15.6(2Y)
SPI_DO: CARD1.7(DAT0) R22.2 R27.1
SPI_SCK: CARD1.5(CLK) U15.3(1Y)
VIDEO: C19.2 C20.2 P3.PIN
VIDEO_SYNC: P3B.1 R9.1 U9.3(1Y) U9.6(2Y)
VIS: U4.2(1B) U6.4(PR) U18.4(\Q)
Net-(C1-1): C1.1 R1.2 U1.12(6Y)
Net-(C1-2): C1.2 R2.1 U1.11(5A)
Net-(C2-2): C2.2 Q2.1(B) R14.1
Net-(C3-1): C3.1 R12.1 U18.15(RCext)
Net-(C3-2): C3.2 U18.14(Cext)
Net-(C4-1): C4.1 R13.1 U18.7(RCext)
Net-(C4-2): C4.2 U18.6(Cext)
Net-(C5-2): C5.2 R1.1 U1.13(6A) X1.1(OSC1)
Net-(C6-2): C6.2 D1.1(K) P2.1 R5.2
Net-(C19-1): C19.1 C20.1 R16.1 R17.2
Net-(C51-1): C51.1 P51.2 P51.3
Net-(C51-2): C51.2 R52.2 R53.2 R56.1
Net-(C52-1): C52.1 P51.4 P51.5
Net-(C52-2): C52.2 R54.2 R55.2 R57.2
Net-(D51-1): D51.1(K) U52.1(1Y)
Net-(D51-2): D51.2(A) D52.2(A) R51.2 U52.5(2A) U52.6(2B)
Net-(LED-1): LED.1 R20.2
Net-(Q1-1): Q1.1(B) R4.1 R5.1
Net-(Q3-1): Q3.1(B) R15.2
Net-(Q3-2): Q3.2(E) R16.2
Net-(Q3-3): Q3.3(C) R10.1 R21.2
Net-(R2-2): R2.2 U1.9(4A) U1.10(5Y) X1.2(OSC2)
Net-(R9-2): R9.2 R10.2 R15.1 R41.2
Net-(R18-1): R18.1 U13.8(Q2)
Net-(R18-2): R18.2 U13.3(MR2)
Net-(R19-2): R19.2 U13.2(MR1)
Net-(R22-1): R22.1 U15.9(3A)
Net-(R23-1): R23.1 U15.12(4A)
Net-(R24-1): R24.1 U15.2(1A)
Net-(R25-1): R25.1 U15.5(2A)
Net-(R26-2): R26.2 U15.8(3Y)
Net-(U4.3-4): U4.4(2A) U18.5(Q)
Net-(U4.3-5): U4.5(2B) U18.13(Q)
Net-(U4.3-6): U4.6(2Y) U9.2(1B) U9.4(2A)
Net-(U4.4-1): U4.1(1A) U18.12(\Q)
Net-(U4.4-3): U4.3(1Y) U9.1(1A) U9.5(2B)
Net-(U9.2-9): U9.9(3A) U9.10(3B) U12.13(QH)
Net-(U21.1-6): U21.6(QD) U26.5(3A)
Net-(U23.1-2): U23.2(D) U23.9(Q)
Net-(U23.2-13): U23.13(CLR) U26.6(3Y)
Net-(U24.2-6): U24.6(2B) U26.4(2Y)
Net-(U24.3-10): U24.10(3Y) U25.2(1B) U25.4(2A)
Net-(U24.4-12): U24.12(4B) U26.2(1Y)
Net-(U24.4-13): U24.13(4Y) U25.10(3B)
Net-(U25.2-5): U25.5(2B) U25.9(3A) U26.8(4Y)
Net-(U52.2-4): U52.4(2Y) U52.9(3B) U52.11(4A)

Not connected (* = marked no-connect by the designer): CARD1 1(DAT2)* 8(DAT1)* 9(CD_SW)*; U1 7(GND) 14(VCC); U2 6(I)*; U4 7(GND) 8(3Y)* 11(4Y)* 14(VCC); U6 6(\Q)* 7(GND) 9(Q)* 14(VCC); U8 18(\HALT)* 23(\BUSACK)*; U9 7(GND) 11(4Y)* 14(VCC); U10 17(O2)*; U13 4(NC)* 6(NC)* 7(NC)* 13(NC)*; U14 10(\Y8)* 11(\Y9)*; U15 7(GND) 14(+3V3); U16 1(Q12)* 2(Q6)* 4(Q7)* 5(Q4)* 6(Q3)* 7(Q2)* 9(Q1)* 12(Q9)* 13(Q8)* 15(Q11)*; U17 1(5)* 3(0)* 4(2)* 5(6)* 6(7)* 7(3)* 10(4)* 12(CO)*; U18 8(GND) 16(VCC); U19 6(\Q)*; U21 3(QA)* 4(QB)* 5(QC)* 7(GND) 8(QD)* 9(QC)* 10(QB)* 14(VCC); U22 5(Q)* 7(GND) 8(\Q)* 14(VCC); U23 7(GND) 8(\Q)* 14(VCC); U24 7(GND); U25 7(GND) 14(VCC); U26 7(GND) 14(VCC); U27 8(Q0)*; U51 2(N.C.)* 5(N.C.)* 6(IOB7)* 7(IOB6)* 8(IOB5)* 9(IOB4)* 10(IOB3)* 11(IOB2)* 12(IOB1)* 13(IOB0)* 14(IOA7)* 15(IOA6)* 16(IOA5)* 17(IOA4)* 18(IOA3)* 19(IOA2)* 20(IOA1)* 21(IOA0)* 26(SEL/)* 39(TEST1)*; U52 7(GND) 14(VCC)

## Notes on the sheets
sheet 1
- Sheet 1
- CPU Clock
  Video Timing
- Sheet 2
- CPU + ROM + RAM
  Reset, NMI reset
  Expansion bus
- Keyboard and latch
- SD card interface
- Sheet 3
- Video ROM, shift out
  register and output
- Tape interface
- Audio Interface
- Based on PVV's Galaksija Plus clone from 2017. Mods:
  - integrated audio interface
  - address decoder with ATF16V8B
  - integrated micro SD socket with level shifters
  - NMI reset circuit
  - hybrid TH/SMD PCB (SMD discrete components on the bottom side)
  - keyboard stackable on the back side (100x300mm)
- Works with the following Galaksija Plus ROM images by PVV:
  - GALAXY_ROM16_v8_6.BIN (16k), alt. GALAXY_v8_6.BIN (64k)
  - GALAXY_CHGRGENP.BIN (8k), alt. GALAXY _CHRGEN.BIN (64k)
  Hardware memory map:
    $0000...$0FFF  ROM "A" or "1" – 4 KB contains bootstrap
    $1000...$1FFF  ROM "B" or "2" – 4 KB (optional)
    $2000...$27FF  Keyboard and latch
    $2800...$BFFF  RAM: 30 KB ($2800...$2BFF Video RAM)
    $C000...$C7FF  RAM: 2 KB (SDOS)
    $C800...$CFFF  SD interface
    $D000...$DFFF  Unused, reserved
    $E000...$FFFF  ROM "3" + "4": 8 KB (Graphics, SDOS etc)
- Credits:
  - Voja Antonic: Galaksija (1983)
  - Nenad Dunjic and Milan Tadic: Galaksija Plus mod (1985)
  - PVV and Fifan: Galaksija Plus clone with SD card (2017)
  - Goran Stankovic (YT2FSG):  Retro Computers web page
  - Retro Bertie (@MacBerti28): YouTube guide
- Soldering sequence:
    1. start with the SMD components on the bottom side
       (the SMD components are 0805+ and easy to solder)
    2. solder the SMD components on the top side
    3. mount the IC sockets
    4. mount the rest of the components
sheet 2
- 6.144 MHz
- 3.072MHz
- 1.536MHz
- 50Hz
- 3.072MHz
- 1.536MHz
- 16kHz HSYNC
- 512kHz
- 16kHz
- RST
  switch
- (1:12 divider)
- 50Hz VSYNC
- NMI
  switch
- Tape Interface (optional)
- Extension Bus
- Keyboard
- open collector
- 3.072MHz
- U2 CUPL definition
- field ADDR = [A15..13]
  UPPER6K = A11 # A12
  Q0 = MREQ & ADDR:0000
  Q1 = MREQ & ADDR:2000
   ...
  Q7 = MREQ & ADDR:E000
  ROM  = Q0 # Q7
  CSE  = Q5
  RAM1 = Q1 & UPPER6K
  RAM2 = Q2 # Q3 # Q4
  RAM3 = Q6 & !UPPER6K
  RAM  = RAM1 # RAM2 # RAM3
  KEY  = Q1 & !UPPER6K
  CSSD = Q6 & UPPER6K
  A13R = Q6 $ A13
  A14R = Q6 $ A14
  A7R = !D13 # A7
- D13 to U2
  D12, D8 to
  Tape Interface
- LATCH @ 0x2038
  D0 -> N.C.
  D1 -> /ROMG
  D2 -> D8 (CHR0,AOUT0)
  D3 -> D9 (CHR1)
  D4 -> D10 (CHR2)
  D5 -> D11 (CHR3)
  D6 -> D12 (AOUT1)
  D7 -> D13 (A7CLMP)
- (100R)
- Data Bus
- (51R)
- Credits:
  Original Galaksija: Voja Antonic
  Galaksija Plus: N. Dunjic, M.Tadic
  Galaksija Plus with SD card: PVV
- A3
sheet 3
- Data Bus
- (global)
- Control Bus
- (global)
- References:
  - GalaksijaPlus_PVV_GAL_NEW6_SD.pdf (2017-12-21)
  - GalaksijaPlus_Fifan_Schematic.pdf (2019-02-21)
  Found on:
- http://www.nedopc.org/forum/viewtopic.php?p=87313
- https://drive.google.com/drive/folders/1J3synVV-5PiKcZs9oFsY-6CqWDRKv7X2
- P21 is connected to an external micro SD card reader,
  for example: https://www.electrokit.com/produkt/microsd-lasare-3-3-5v/
  (this is cheaper than to buy and solder U15, U3 and CARD1)
- 768kHz
- 1.536MHz
- A built-in micro SD card reader with level shifters and 3.3V PS (optional)
- Connect to P21
- SPI_CS << SD_\CS
- SPI_DI << SD_MOSI
- SPI_SCK << SD_SCK
- SPI_DO >> SD_MISO
- (OPTIONAL)
- Credits: PVV
- A3
sheet 4
- CPU Bus (global)
- Audio socket 3.5mm
  PJ-324
  EBS 35
  LUM KLBR 4
- \SEL has an internal pull-up
  so it can be left unconnected.
- RES/ is not used.
  Pin 23 of U51 is connected to \NMS.
- Schematics by PVV
- (OPTIONAL)
- Credits: PVV
- A4
